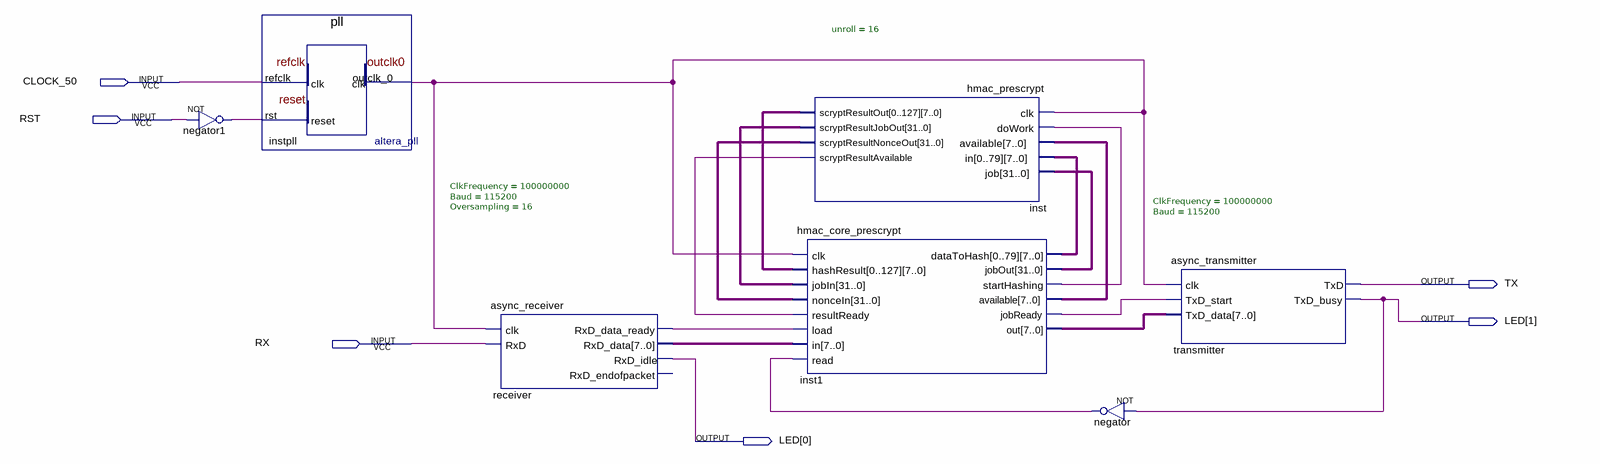
[diagram p0: schematic sheet]
// Quartus schematic hmac_prescrypt_test_top.bdf as structural Verilog: 7 symbols, 6 pins
module hmac_prescrypt_test_top (
  input  CLOCK_50,
  input  RST,
  input  RX,
  output TX,
  output [1:0] LED
);

  wire inst1_jobready, inst1_starthashing, inst_scryptresultavailable, instpll_outclk_0, negator1_out,
       negator_out, receiver_rxd_data_ready;
  wire [7:0] inst1_available, inst1_out, receiver_rxd_data;
  wire [31:0] inst1_jobout, inst_scryptresultjobout, inst_scryptresultnonceout;
  wire [639:0] inst1_datatohash;
  wire [1023:0] inst_scryptresultout;

  not negator1 (negator1_out, RST);
  pll instpll (.refclk(CLOCK_50), .rst(negator1_out), .outclk_0(instpll_outclk_0));
  async_receiver #(.ClkFrequency(100000000), .Baud(115200), .Oversampling(16)) receiver (
    .clk(instpll_outclk_0), .RxD(RX), .RxD_data_ready(receiver_rxd_data_ready), .RxD_data(receiver_rxd_data),
    .RxD_idle(LED[0]));  // open: RxD_endofpacket
  hmac_prescrypt #(.unroll(16)) inst (
    .clk(instpll_outclk_0), .doWork(inst1_starthashing), .available(inst1_available), .in(inst1_datatohash),
    .job(inst1_jobout), .scryptResultOut(inst_scryptresultout), .scryptResultJobOut(inst_scryptresultjobout),
    .scryptResultNonceOut(inst_scryptresultnonceout), .scryptResultAvailable(inst_scryptresultavailable));
  hmac_core_prescrypt inst1 (
    .clk(instpll_outclk_0), .hashResult(inst_scryptresultout), .jobIn(inst_scryptresultjobout),
    .nonceIn(inst_scryptresultnonceout), .resultReady(inst_scryptresultavailable),
    .load(receiver_rxd_data_ready), .in(receiver_rxd_data), .read(negator_out),
    .dataToHash(inst1_datatohash), .jobOut(inst1_jobout), .startHashing(inst1_starthashing),
    .available(inst1_available), .jobReady(inst1_jobready), .out(inst1_out));
  not negator (negator_out, LED[1]);
  async_transmitter #(.ClkFrequency(100000000), .Baud(115200)) transmitter (
    .clk(instpll_outclk_0), .TxD_start(inst1_jobready), .TxD_data(inst1_out), .TxD(TX), .TxD_busy(LED[1]));
endmodule
